# Altium schematic sheet 534_Botones.SchDoc
size A4; SheetNumber: 17; SheetTotal: 19
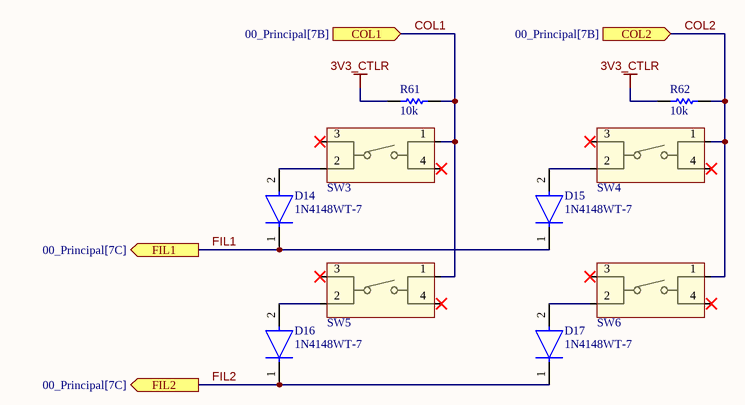
[diagram p0: 534_Botones.SchDoc]

## Parts
D14  1N4148WT-7  [FP-SOD523-MFG]
D15  1N4148WT-7  [FP-SOD523-MFG]
D16  1N4148WT-7  [FP-SOD523-MFG]
D17  1N4148WT-7  [FP-SOD523-MFG]
R61  10k  [RESC1005X40X25ML05T05]
R62  10k  [RESC1005X40X25ML05T05]
SW3  KSC441G70SHLFSPF  [KSC441G 70SH LFS PF]  (value not drawn)
SW4  KSC441G70SHLFSPF  [KSC441G 70SH LFS PF]  (value not drawn)
SW5  KSC441G70SHLFSPF  [KSC441G 70SH LFS PF]  (value not drawn)
SW6  KSC441G70SHLFSPF  [KSC441G 70SH LFS PF]  (value not drawn)

## Ports
COL1 (in, see 00_Principal[7B]), COL2 (in, see 00_Principal[7B]), FIL1 (out, see 00_Principal[7C]), FIL2 (out, see 00_Principal[7C])

## Nets
3V3_CTLR: R61.2 R62.2
COL1: R61.1 SW3.1 SW5.1 ; port COL1
COL2: R62.1 SW4.1 SW6.1 ; port COL2
FIL1: D14.1(C) D15.1(C) ; port FIL1
FIL2: D16.1(C) D17.1(C) ; port FIL2
NetD14_2: D14.2(A) SW3.2
NetD15_2: D15.2(A) SW4.2
NetD16_2: D16.2(A) SW5.2
NetD17_2: D17.2(A) SW6.2

Not connected (* = marked no-connect by the designer): SW3 3(2)* 4(3)*; SW4 3(2)* 4(3)*; SW5 3(2)* 4(3)*; SW6 3(2)* 4(3)*

## Library data of the parts
D14-D17 = CMP-2000-05518-3: DIODE GEN PURP 80V 125MA SOD523; Power Rating: 150mW; Peak Non-Repetitive Surge Current: 2A; Forward Voltage: 1.25V; Reverse Recovery Time: 4ns; Peak Reverse Current: 1uA; Max Repetitive Reverse Voltage (Vrrm): 100V; Capacitance: 2pF; Polarity: Standard; Element Configuration: Single; Forward Current: 250mA; Lead Free: Lead Free; Packaging: Tape and Reel; Length: 0.9mm; Min Operating Temperature: -65°C; Current Rating: 125mA; Max Reverse Voltage (DC): 80V; Width: 1.3mm; Package Quantity: 3000; Output Current: 125mA; Power Dissipation: 150mW; Max Operating Temperature: 150°C; Radiation Hardening: No; Average Rectified Current: 125mA; Height: 0.65mm; Voltage Rating (DC): 80V; Max Surge Current: 2A; Weight: 3.5E-05oz; Recovery Time: 4ns; Max Forward Surge Current (Ifsm): 2A; Contact Plating: Tin; Number of Pins: 2; Mount: Surface Mount; REACH SVHC: No SVHC
R61 R62 = CMP-2002-00601-1: Manufacturer: Panasonic; Part Number: ERJ-2RHD1002X
SW3-SW6 = KSC441G70SHLFSPF: Switch Tactile N.O. SPST Button 1VA 32VDC 50mA 4N Gull Wing SMD T/R; Manufacturer: C&K Components; Supplier: DigiKey; Supplier Part Number: CKN11980CT-ND; Manufacturer Part Number: KSC441G70SHLFSPF; RoHS: Compliant; Category: Tactile Switches; Stock: 1; Pricing: 1=1.04, 10=0.887, 25=0.8248, 100=0.7353, 250=0.6812, 500=0.64368 (USD); Contact Current Rating: 50mA; Operating Force: 4N; ComponentLink1URL: https://datasheet.octopart.com:443/KSC441G70SHLFSPF-C%26K-Components-datasheet-128529453.pdf?src-supplier=Electro+Sonic; ComponentLink1Description: https://datasheet.octopart.com:443/KSC441G70SHLFSPF-C%26K-Components-datasheet-128529453.pdf?src-supplier=Electro+Sonic; ComponentLink2URL: https://datasheet.octopart.com:443/KSC441G70SHLFSPF-C%26K-Components-datasheet-100062959.pdf?src-supplier=Future+Electronics; ComponentLink2Description: https://datasheet.octopart.com:443/KSC441G70SHLFSPF-C%26K-Components-datasheet-100062959.pdf?src-supplier=Future+Electronics; Supplier 1: DigiKey; Supplier Part Number 1: CKN11980CT-ND